# Altium project hexbot_矩阵键盘.PrjPcb
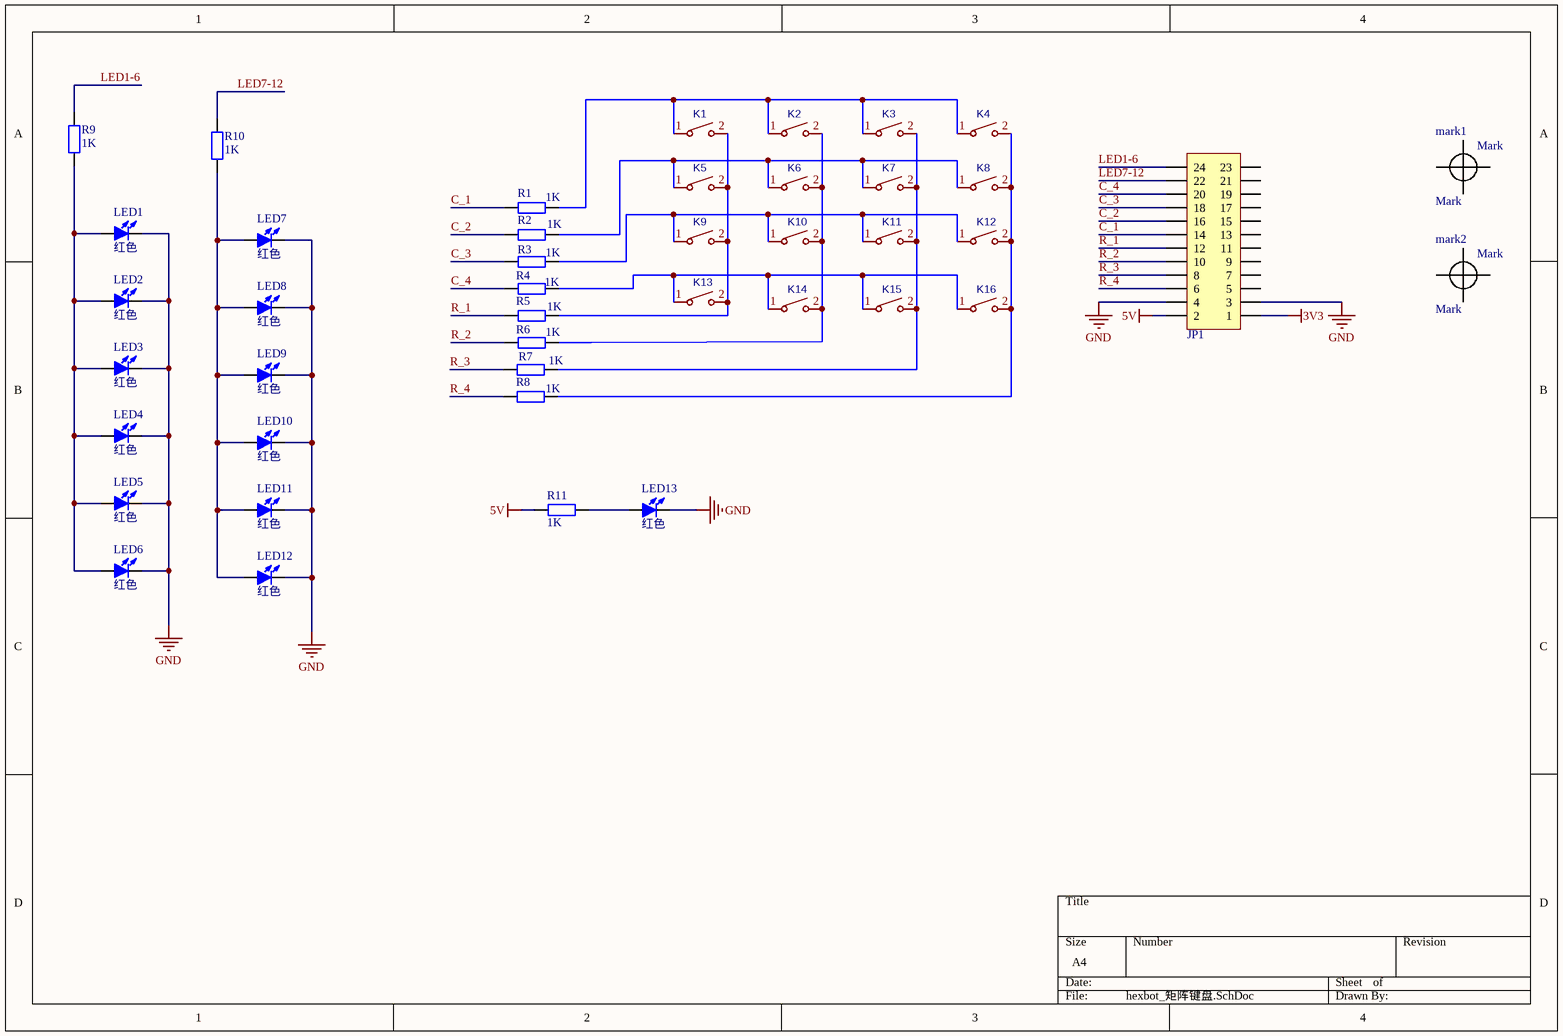
[diagram p0: hexbot_矩阵键盘.SchDoc]
1 sheet, 43 parts. Net scope: global (net labels, ports and power ports of the same name join across sheets).
Board file: Hexbot_矩阵键盘.PcbDoc

## Sheet hexbot_矩阵键盘.SchDoc
size A4

### Parts
JP1  Header 2X11  [HDR2.54-WI-2x12P]  (value not drawn)
K1  轻触开关3*6*2.5  [按键开关]  (value not drawn)
K2  轻触开关3*6*2.5  [按键开关]  (value not drawn)
K3  轻触开关3*6*2.5  [按键开关]  (value not drawn)
K4  轻触开关3*6*2.5  [按键开关]  (value not drawn)
K5  轻触开关3*6*2.5  [按键开关]  (value not drawn)
K6  轻触开关3*6*2.5  [按键开关]  (value not drawn)
K7  轻触开关3*6*2.5  [按键开关]  (value not drawn)
K8  轻触开关3*6*2.5  [按键开关]  (value not drawn)
K9  轻触开关3*6*2.5  [按键开关]  (value not drawn)
K10  轻触开关3*6*2.5  [按键开关]  (value not drawn)
K11  轻触开关3*6*2.5  [按键开关]  (value not drawn)
K12  轻触开关3*6*2.5  [按键开关]  (value not drawn)
K13  轻触开关3*6*2.5  [按键开关]  (value not drawn)
K14  轻触开关3*6*2.5  [按键开关]  (value not drawn)
K15  轻触开关3*6*2.5  [按键开关]  (value not drawn)
K16  轻触开关3*6*2.5  [按键开关]  (value not drawn)
LED1  红色  [LED 0603R]
LED2  红色  [LED 0603R]
LED3  红色  [LED 0603R]
LED4  红色  [LED 0603R]
LED5  红色  [LED 0603R]
LED6  红色  [LED 0603R]
LED7  红色  [LED 0603R]
LED8  红色  [LED 0603R]
LED9  红色  [LED 0603R]
LED10  红色  [LED 0603R]
LED11  红色  [LED 0603R]
LED12  红色  [LED 0603R]
LED13  红色  [LED 0603R]
mark1  Mark  [Mark]  (no BOM)
mark2  Mark  [Mark]  (no BOM)
R1  1K  [R 0603_L]
R2  1K  [R 0603_L]
R3  1K  [R 0603_L]
R4  1K  [R 0603_L]
R5  1K  [R 0603_L]
R6  1K  [R 0603_L]
R7  1K  [R 0603_L]
R8  1K  [R 0603_L]
R9  1K  [R 0603_L]
R10  1K  [R 0603_L]
R11  1K  [R 0603_L]

### Nets
3V3: JP1.1
5V: JP1.2 R11.2
GND: JP1.3 JP1.4 LED1.2(K) LED2.2(K) LED3.2(K) LED4.2(K) LED5.2(K) LED6.2(K) LED7.2(K) LED8.2(K) LED9.2(K) LED10.2(K) LED11.2(K) LED12.2(K) LED13.2(K)
C_1: JP1.14 R1.1
C_2: JP1.16 R2.1
C_3: JP1.18 R3.1
C_4: JP1.20 R4.1
LED1-6: JP1.24 R9.2
LED7-12: JP1.22 R10.2
R_1: JP1.12 R5.1
R_2: JP1.10 R6.1
R_3: JP1.8 R7.1
R_4: JP1.6 R8.1
NetK1_1: K1.1 K2.1 K3.1 K4.1 R1.2
NetK1_2: K1.2 K5.2 K9.2 K13.2 R5.2
NetK2_2: K2.2 K6.2 K10.2 K14.2 R6.2
NetK3_2: K3.2 K7.2 K11.2 K15.2 R7.2
NetK4_2: K4.2 K8.2 K12.2 K16.2 R8.2
NetK5_1: K5.1 K6.1 K7.1 K8.1 R2.2
NetK9_1: K9.1 K10.1 K11.1 K12.1 R3.2
NetK13_1: K13.1 K14.1 K15.1 K16.1 R4.2
NetLED1_1: LED1.1(A) LED2.1(A) LED3.1(A) LED4.1(A) LED5.1(A) LED6.1(A) R9.1
NetLED7_1: LED7.1(A) LED8.1(A) LED9.1(A) LED10.1(A) LED11.1(A) LED12.1(A) R10.1
NetLED13_1: LED13.1(A) R11.1

Not connected (* = marked no-connect by the designer): JP1 5 7 9 11 13 15 17 19 21 23

### Library data of the parts
JP1 = Header 12X2: 12*2P接插件; 版权归属: 封装库来自淘宝卖家 ID：黄晶宝石; BOM名称: 12*2P接插件; 学习资源: https://shop463601444.taobao.com
K1-K16 = 轻触开关3*6*2.5: BOM_Manufacturer: null; Contributor: LCSC; BOM_Supplier: LCSC; BOM_Supplier Part: C9900005901; BOM_Manufacturer Part: 轻触开关3*6*2.5; BOM_JLCPCB Part Class: Extended Part; spicePre: U; spiceSymbolName: 轻触开关3*6*2.5
LED1-LED13 = LED-SMD: 贴片LED; 版权归属: 封装库来自淘宝 ID：黄晶宝石; BOM名称: 贴片LED; 学习资源: https://shop463601444.taobao.com
R1-R11 = R: 贴片电阻; 版权归属: 来自淘宝 ID：黄晶宝石; 封装库来自淘宝卖家 ID：黄晶宝石: 其他店铺购入均为盗版，不享受售后技术支持服务，请立即申请退款; BOM名称: 贴片电阻; 联系售后: https://shop463601444.taobao.com